# EAGLE design VLT_1_0 (EAGLE 8.3.2)
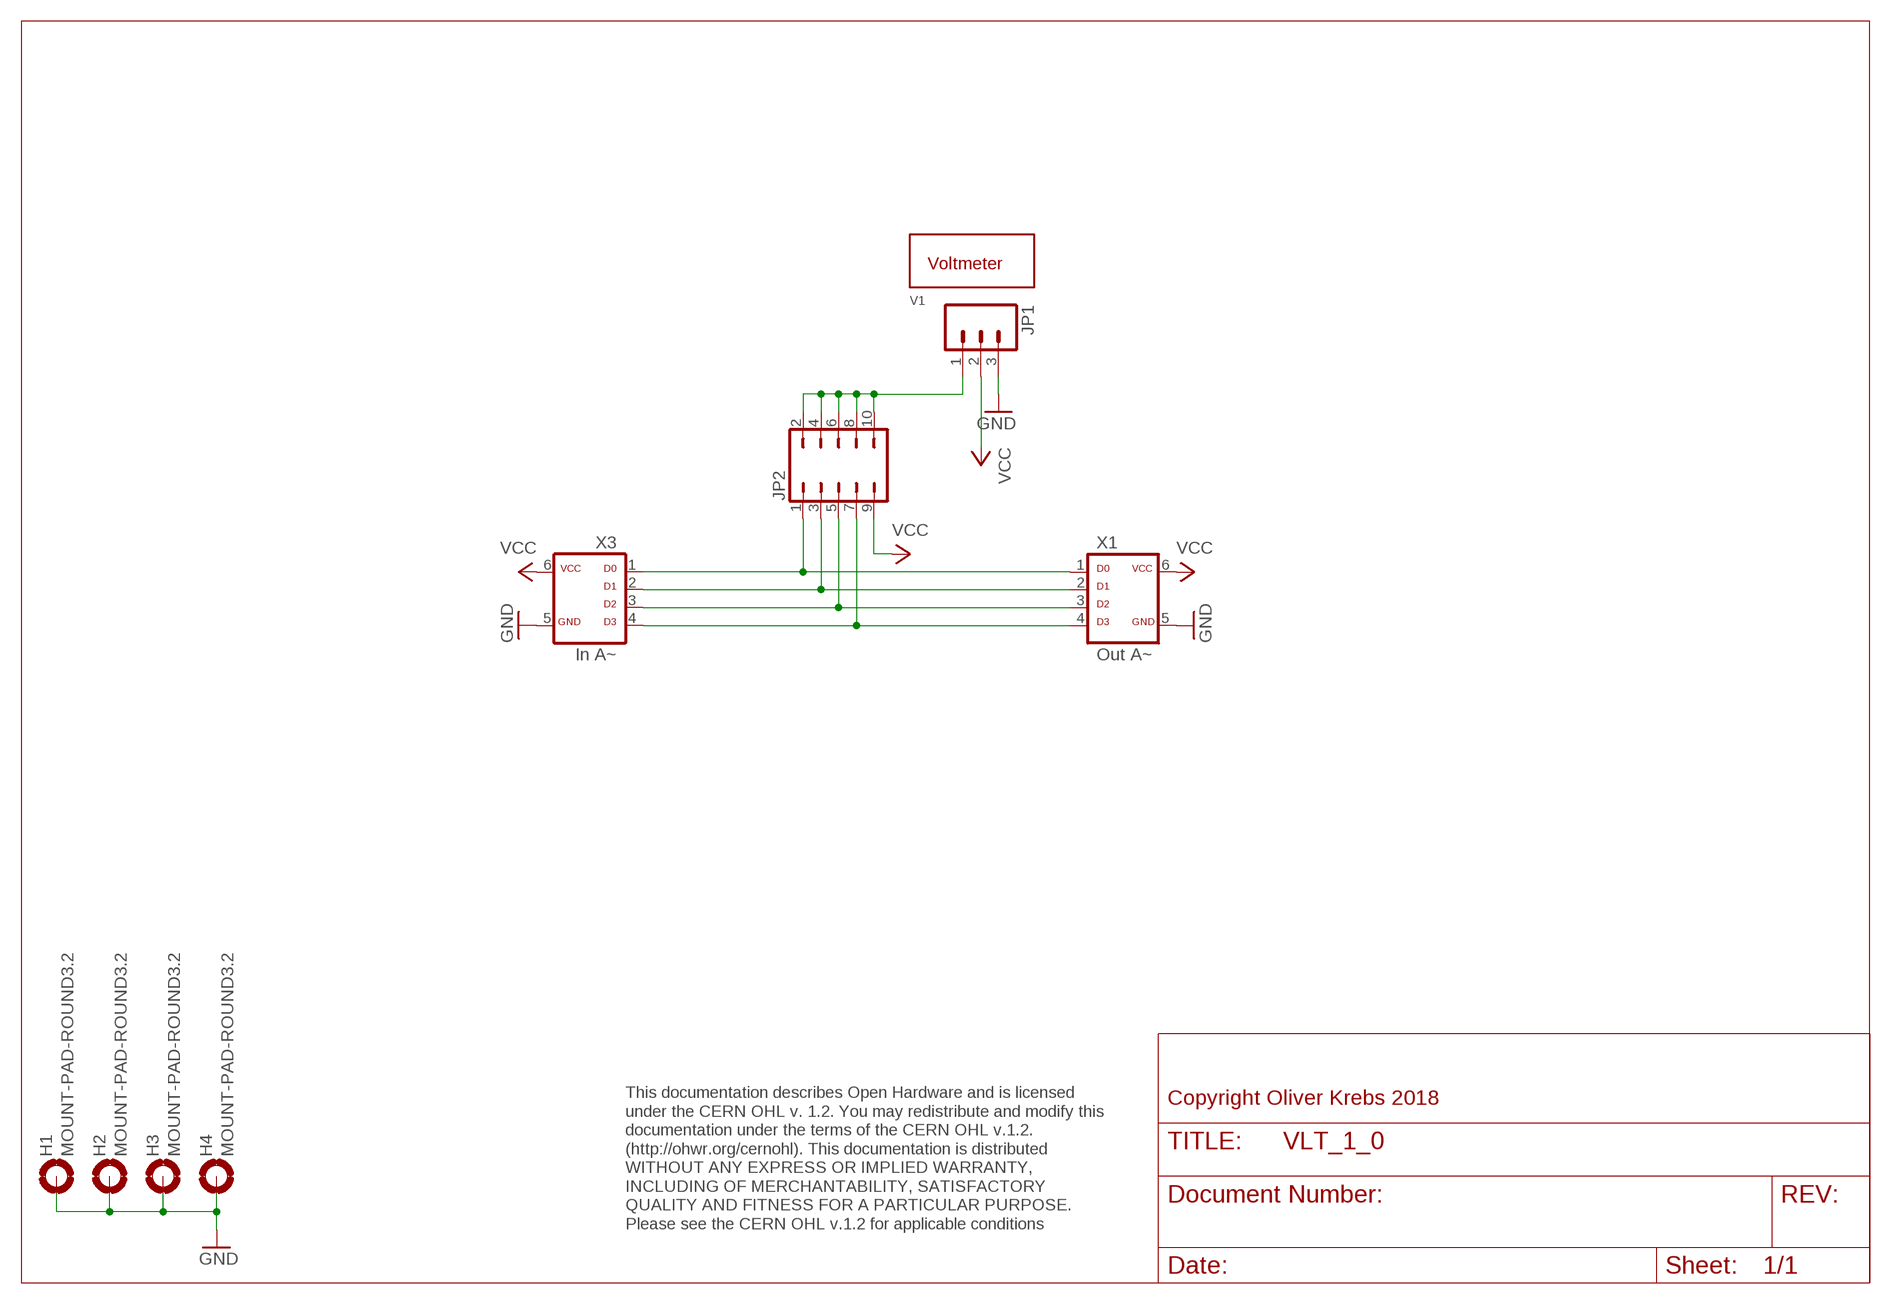
[diagram p0: schematic, sheet 1]

## Parts
H1  MOUNT-PAD-ROUND3.2  [3,2-PAD]
H2  MOUNT-PAD-ROUND3.2  [3,2-PAD]
H3  MOUNT-PAD-ROUND3.2  [3,2-PAD]
H4  MOUNT-PAD-ROUND3.2  [3,2-PAD]
JP1  M03PTH  [1X03]
JP2  JP5Q  [JP5Q]
V1  VOLTMETER-28  [VOLTMETER-28]
X1  Out A~  ML6D  [ML-6]
X3  In A~  ML6D  [ML-6]

## Nets
GND: H1.B3,2(MOUNT) H2.B3,2(MOUNT) H3.B3,2(MOUNT) H4.B3,2(MOUNT) JP1.3 X1.5 X3.5
N$1: JP2.1 X1.1 X3.1
N$2: JP2.3 X1.2 X3.2
N$3: JP2.5 X1.3 X3.3
N$4: JP2.7 X1.4 X3.4
N$5: JP1.1 JP2.2 JP2.4 JP2.6 JP2.8 JP2.10
VCC: JP1.2 JP2.9 X1.6 X3.6

## Notes on the sheet
- Copyright Oliver Krebs 2018
- This documentation describes Open Hardware and is licensed 
  under the CERN OHL v. 1.2. You may redistribute and modify this 
  documentation under the terms of the CERN OHL v.1.2. 
  (http://ohwr.org/cernohl). This documentation is distributed
  WITHOUT ANY EXPRESS OR IMPLIED WARRANTY, 
  INCLUDING OF MERCHANTABILITY, SATISFACTORY 
  QUALITY AND FITNESS FOR A PARTICULAR PURPOSE. 
  Please see the CERN OHL v.1.2 for applicable conditions

## Library data of the parts
H1-H4 = holes:MOUNT-PAD-ROUND: MOUNTING PAD, round
JP1 = SparkFun-Connectors:M03: Header 3 Standard 3-pin 0.1" header. Use with straight break away headers (SKU : PRT-00116), right angle break away headers (PRT-00553), swiss pins (PRT-00743), machine pins (PRT-00117), and female headers (PRT-00115). Molex polarized connector foot print use with SKU : PRT-08232 with associated crimp pins and housings.
JP2 = 01-my-jumper:JP5Q: JUMPER
V1 = 01-my-con:VOLTMETER
X1 X3 = 01-my-con:ML6D

## Board
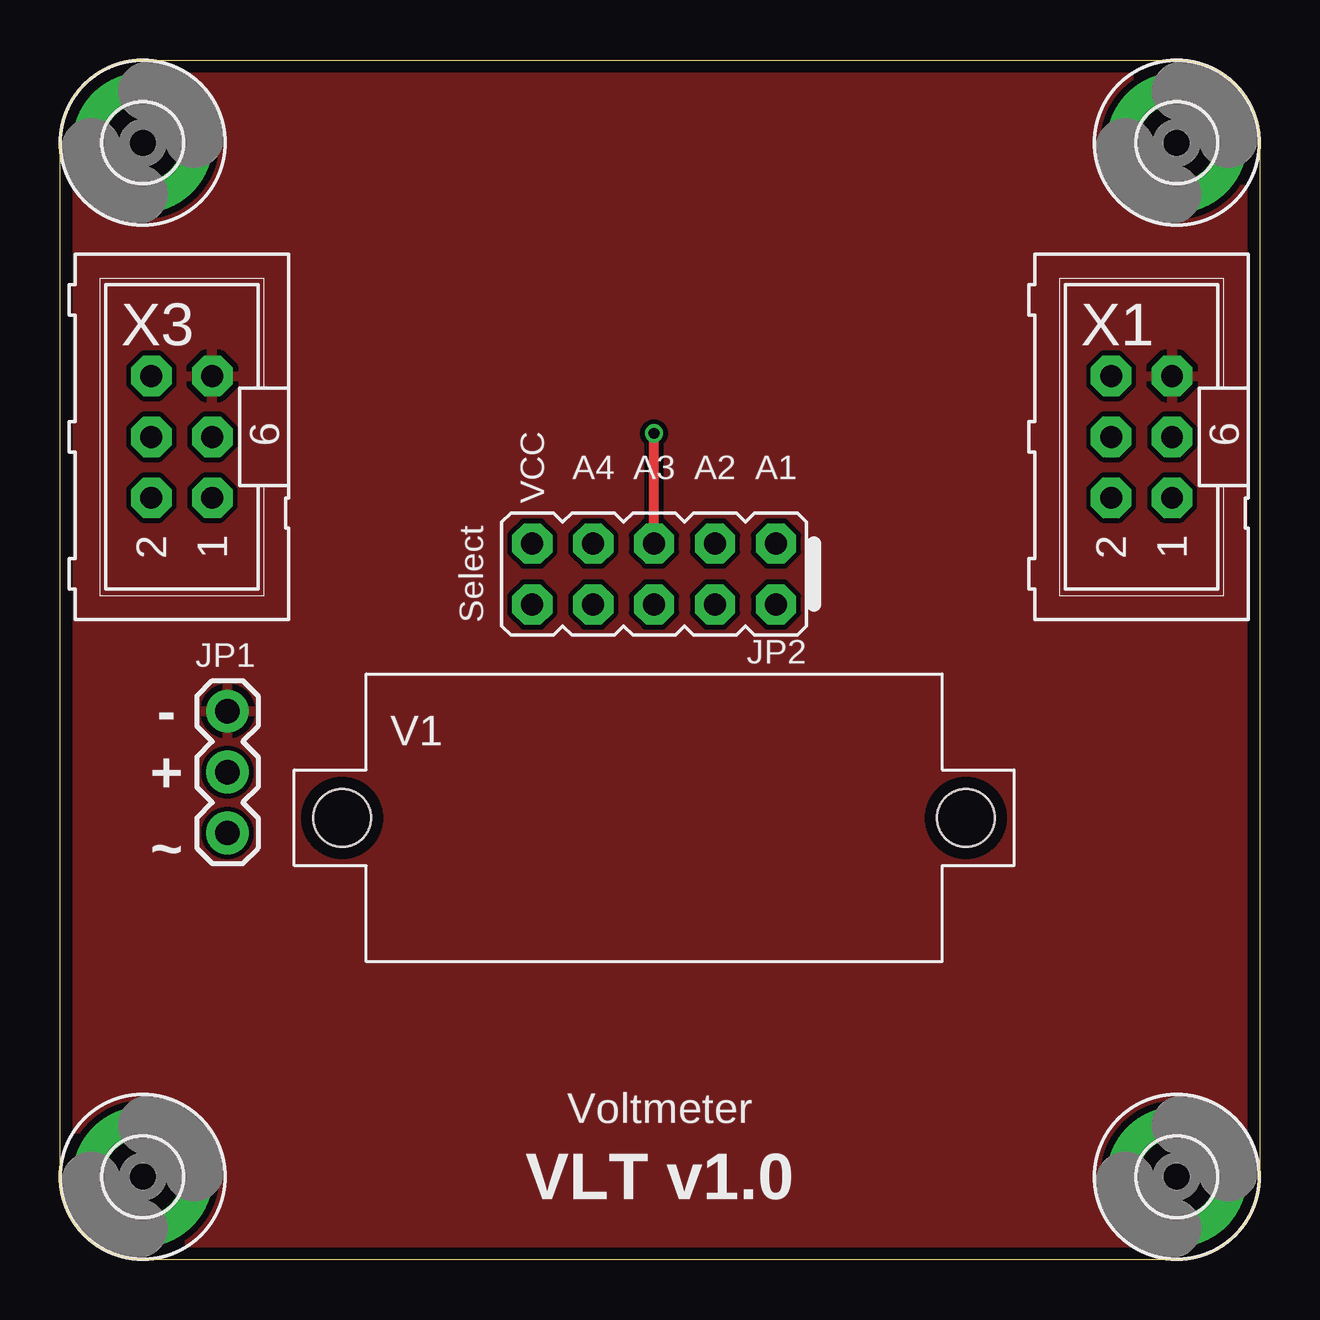
[diagram p1: board, top side]
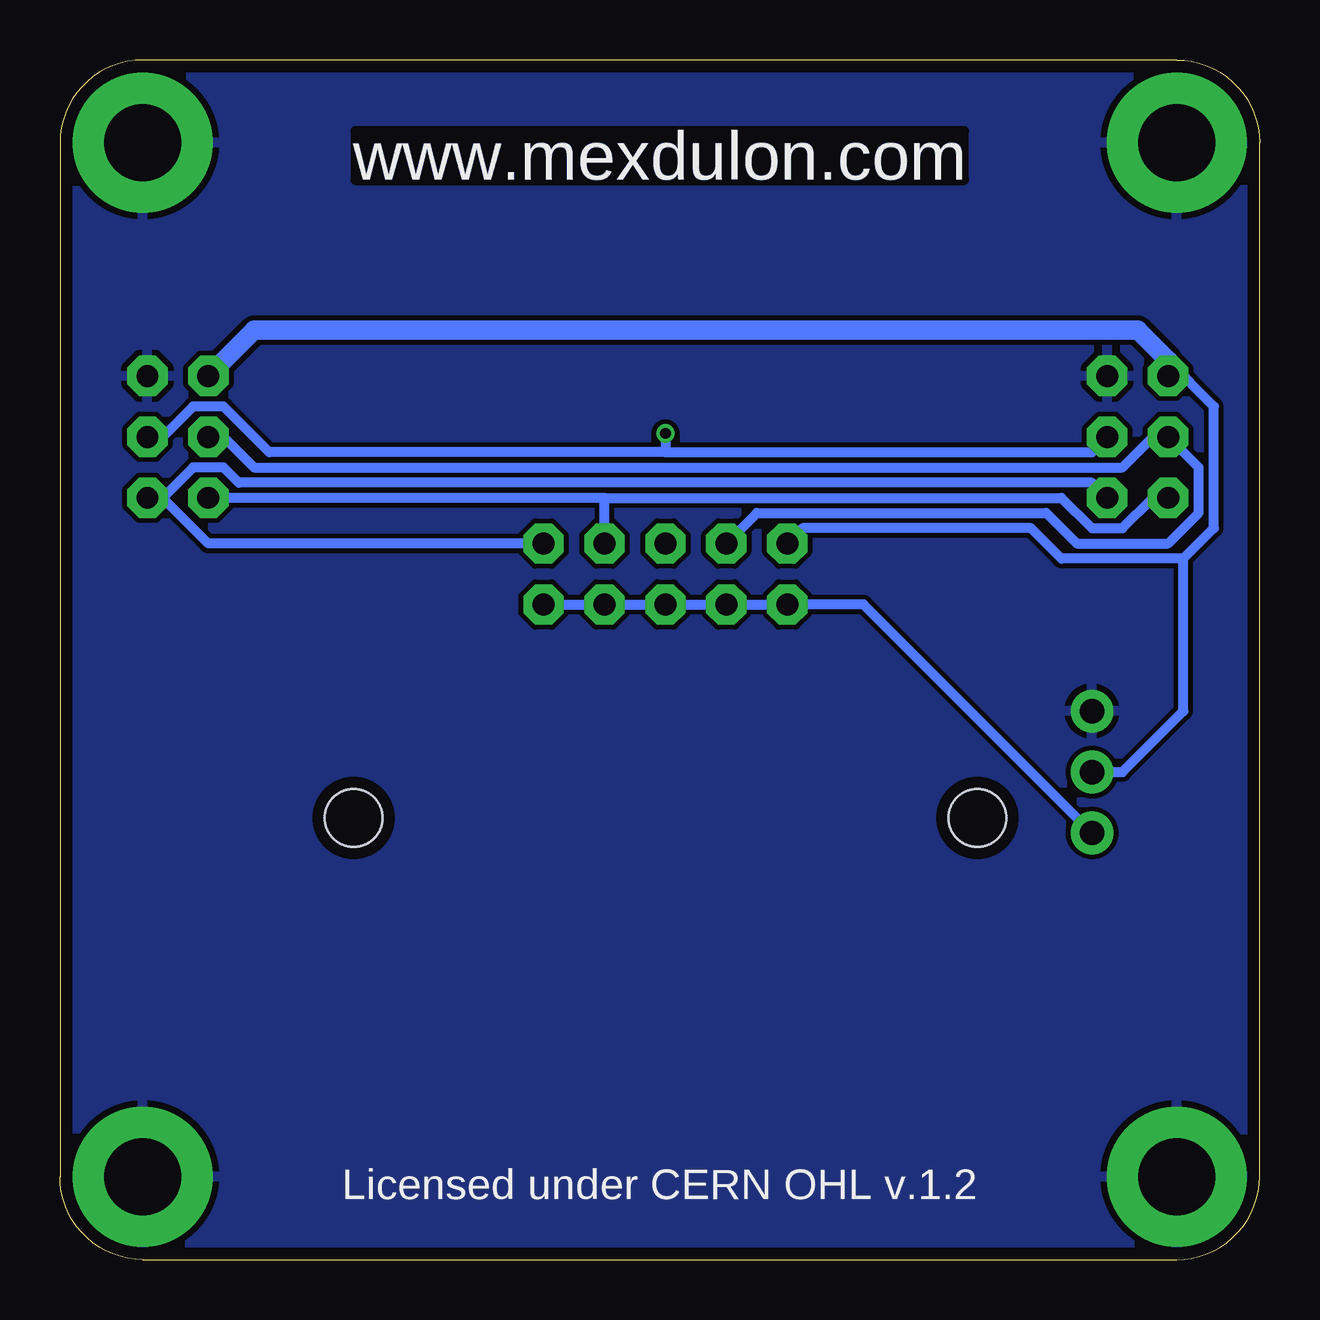
[diagram p2: board, bottom side, seen from below]

Size 50 x 50 mm. Coordinates in mm from the lower left corner, seen from the top.
Outline: 0,3.45 0,46.55 arc-90 3.45,50 46.55,50 arc-90 50,46.55 50,3.45 arc-90 46.55,0 3.45,0 arc-90 0,3.45
Copper layers (1*16): Top 0.035mm / dielectric 1.6mm / Bottom 0.035mm
Design rules "Elecrow_2-layer_PCB_eagle_rule_8mil": minimum track width 8mil, minimum drill 12mil, track to track 8mil, track to pad 8mil, pad to pad 8mil, via to via 8mil, smd to smd 0mil, copper to edge 20mil, drill to drill 10mil, minimum pad ring 6mil, minimum via ring 6mil, stop-mask expansion 0mil, vias tented up to drill 100mil, thermal gap 10mil

### Footprints (pad centres in the part's own frame; a part is rotated, then mirrored left to right if it is on the bottom)
3,2-PAD = drill 3.2 pad 5.842: B3,2 0,0
1X03 = drill 1.016 pad 1.778: 1 0,0; 2 2.54,0; 3 5.08,0
JP5Q = drill 0.914 pad 1.676 octagon: 1 -5.08,-1.27; 2 -5.08,1.27; 3 -2.54,-1.27; 4 -2.54,1.27; 5 0,-1.27; 6 0,1.27; 7 2.54,-1.27; 8 2.54,1.27; 9 5.08,-1.27; 10 5.08,1.27
VOLTMETER-28 = hole 2.4: -13,0; 13,0
ML-6 = drill 0.914 pad 1.676 octagon: 1 -2.54,-1.27; 2 -2.54,1.27; 3 0,-1.27; 4 0,1.27; 5 2.54,-1.27; 6 2.54,1.27

### Placement (x,y rotation side)
H1  3.45,3.45 0 top
H2  3.45,46.55 0 top
H3  46.55,46.55 0 top
H4  46.55,3.45 0 top
JP1  6.99,17.78 90 top
JP2  24.77,28.57 180 top
V1  24.77,18.41 0 top
X1  45.09,34.29 90 top
X3  5.08,34.29 90 top

### Tracks (layer width: path | path; a pad name or v marks a point on that pad's centre or on a via)
GND
  pour Bottom (isolate 0.203): 0,50.16 50.8,50.16 50.8,0 0,0
  pour Top (isolate 0.203): 0,50.16 50.8,50.16 50.8,0 0,0
N$1
  Bottom 0.406: 45.72,31.75 44.45,33.02 43.18,33.02 42.55,32.38 6.99,32.38 X3.1 | 45.72,31.75 X1.1 | JP2.1 43.81,29.84 45.72,31.75
N$2
  Bottom 0.406: 27.3,31.75 X1.2 | 27.3,31.75 8.26,31.75 6.99,30.48 5.71,30.48 4.45,31.75 X3.2 | JP2.3 27.3,31.75
N$3  (via drill 0.45)
  Top 0.406: JP2.5 v24.77,34.44
  Bottom 0.406: X1.3 45.72,34.29 44.45,35.56 43.18,35.56 41.27,33.66 24.77,33.66 | X3.3 6.99,33.66 24.77,33.66 | v24.77,34.44 24.77,33.66
N$4
  Bottom 0.406: X1.4 43.18,34.29 41.91,33.02 5.71,33.02 4.45,34.29 X3.4 2.54,33.02 2.54,31.11 3.81,29.84 7.62,29.84 8.89,31.11 20.95,31.11 JP2.7
N$5
  Bottom 0.406: JP2.2 JP2.4 JP2.6 JP2.8 JP2.10 16.51,27.3 JP1.1
VCC
  Bottom 0.406: 3.17,29.21 8.26,29.21 9.53,30.48 19.05,30.48 JP2.9 | 3.17,29.21 1.91,30.48 1.91,35.56 3.81,37.47 | JP1.2 5.71,20.32 3.17,22.86 3.17,29.21
  Bottom 0.813: X3.6 3.81,37.47 5.08,38.73 41.91,38.73 X1.6

### Text on the board
Bottom: www.mexdulon.com
tPlace: VCC | A4 | A3 | A2 | A1 | Select | - | + | ~
tNames: Voltmeter | VLT v1.0
bNames: www.mexdulon.com | Licensed under CERN OHL v.1.2
200bmp: E:/Bilder/Elektronik/Modulion/Mexdulon/mexdulon_50x50_pcb.bmp